# Altium schematic sheet Sheet1.SchDoc
size A4
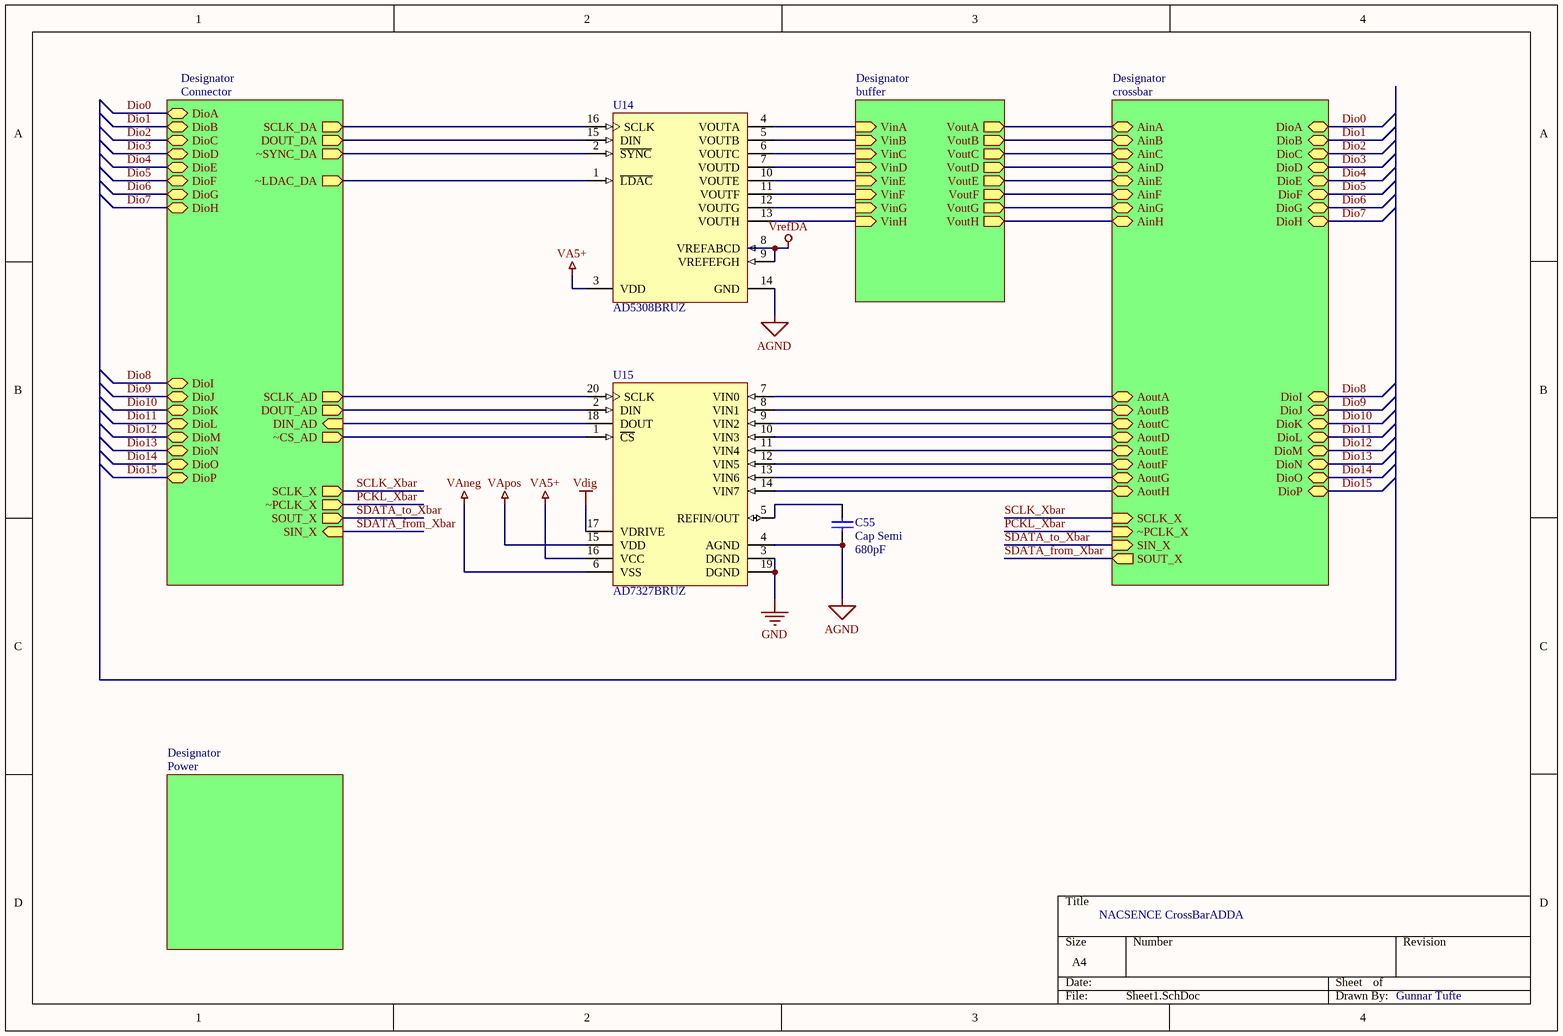
[diagram p0: Sheet1.SchDoc]

## Parts
C55  Cap Semi  value 680pF  [C1206]
U14  AD5308BRUZ  [RU-16_N]
U15  AD7327BRUZ  [RU-20_N]

## Sub-sheets
Designator = buffer: VinA (in), VinB (in), VinC (in), VinD (in), VinE (in), VinF (in), VinG (in), VinH (in), VoutA (out), VoutB (out), VoutC (out), VoutD (out), VoutE (out), VoutF (out), VoutG (out), VoutH (out)
Designator = crossbar: AinA, AinB, AinD, AinC, AinE, AinF, AinG, AinH, AoutA, AoutB, AoutD, AoutC, AoutE, AoutF, AoutG, AoutH, DioA, DioB, DioC, DioD, DioE, DioG, DioF, DioH, DioI, DioJ, DioK, DioL, DioM, DioN, DioO, DioP, SOUT_X (out), SIN_X (in), ~PCLK_X (in), SCLK_X (in)
Designator = Connector: SCLK_DA (out), DOUT_DA (out), ~SYNC_DA (out), ~LDAC_DA (out), SCLK_AD (out), DOUT_AD (out), DIN_AD (in), ~CS_AD (out), SCLK_X (out), ~PCLK_X (out), SOUT_X (out), SIN_X (in), DioA, DioB, DioC, DioD, DioE, DioG, DioF, DioH, DioI, DioJ, DioK, DioL, DioM, DioN, DioO, DioP
Designator = Power: no entries

## Nets
AGND: C55.2 U14.14(GND) U15.4(AGND)
GND: U15.3(DGND) U15.19(DGND)
VA5+: U14.3(VDD) U15.16(VCC)
VAneg: U15.6(VSS)
VApos: U15.15(VDD)
Vdig: U15.17(VDRIVE)
VrefDA: U14.8(VREFABCD) U14.9(VREFEFGH)
Dio0: sheet Designator/DioA, sheet Designator/DioA
Dio1: sheet Designator/DioB, sheet Designator/DioB
Dio2: sheet Designator/DioC, sheet Designator/DioC
Dio3: sheet Designator/DioD, sheet Designator/DioD
Dio4: sheet Designator/DioE, sheet Designator/DioE
Dio5: sheet Designator/DioF, sheet Designator/DioF
Dio6: sheet Designator/DioG, sheet Designator/DioG
Dio7: sheet Designator/DioH, sheet Designator/DioH
Dio8: sheet Designator/DioI, sheet Designator/DioI
Dio9: sheet Designator/DioJ, sheet Designator/DioJ
Dio10: sheet Designator/DioK, sheet Designator/DioK
Dio11: sheet Designator/DioL, sheet Designator/DioL
Dio12: sheet Designator/DioM, sheet Designator/DioM
Dio13: sheet Designator/DioN, sheet Designator/DioN
Dio14: sheet Designator/DioO, sheet Designator/DioO
Dio15: sheet Designator/DioP, sheet Designator/DioP
PCKL_Xbar: sheet Designator/~PCLK_X, sheet Designator/~PCLK_X
SCLK_Xbar: sheet Designator/SCLK_X, sheet Designator/SCLK_X
SDATA_from_Xbar: sheet Designator/SOUT_X, sheet Designator/SIN_X
SDATA_to_Xbar: sheet Designator/SIN_X, sheet Designator/SOUT_X
NetC55_1: C55.1 U15.5(REFIN/OUT)
NetU14_1: U14.1(~{LDAC}) ; sheet Designator/~LDAC_DA
NetU14_2: U14.2(~{SYNC}) ; sheet Designator/~SYNC_DA
NetU14_4: U14.4(VOUTA) ; sheet Designator/VinA
NetU14_5: U14.5(VOUTB) ; sheet Designator/VinB
NetU14_6: U14.6(VOUTC) ; sheet Designator/VinC
NetU14_7: U14.7(VOUTD) ; sheet Designator/VinD
NetU14_10: U14.10(VOUTE) ; sheet Designator/VinE
NetU14_11: U14.11(VOUTF) ; sheet Designator/VinF
NetU14_12: U14.12(VOUTG) ; sheet Designator/VinG
NetU14_13: U14.13(VOUTH) ; sheet Designator/VinH
NetU14_15: U14.15(DIN) ; sheet Designator/DOUT_DA
NetU14_16: U14.16(SCLK) ; sheet Designator/SCLK_DA
NetU15_1: U15.1(~{CS}) ; sheet Designator/~CS_AD
NetU15_2: U15.2(DIN) ; sheet Designator/DOUT_AD
NetU15_7: U15.7(VIN0) ; sheet Designator/AoutA
NetU15_8: U15.8(VIN1) ; sheet Designator/AoutB
NetU15_9: U15.9(VIN2) ; sheet Designator/AoutC
NetU15_10: U15.10(VIN3) ; sheet Designator/AoutD
NetU15_11: U15.11(VIN4) ; sheet Designator/AoutE
NetU15_12: U15.12(VIN5) ; sheet Designator/AoutF
NetU15_13: U15.13(VIN6) ; sheet Designator/AoutG
NetU15_14: U15.14(VIN7) ; sheet Designator/AoutH
NetU15_18: U15.18(DOUT) ; sheet Designator/DIN_AD
NetU15_20: U15.20(SCLK) ; sheet Designator/SCLK_AD
(unnamed): sheet Designator/VoutA, sheet Designator/AinA
(unnamed): sheet Designator/VoutB, sheet Designator/AinB
(unnamed): sheet Designator/VoutC, sheet Designator/AinC
(unnamed): sheet Designator/VoutD, sheet Designator/AinD
(unnamed): sheet Designator/VoutE, sheet Designator/AinE
(unnamed): sheet Designator/VoutF, sheet Designator/AinF
(unnamed): sheet Designator/VoutG, sheet Designator/AinG
(unnamed): sheet Designator/VoutH, sheet Designator/AinH

## Notes on the sheet
- NACSENCE CrossBarADDA
- Gunnar Tufte

## Library data of the parts
C55 = Cap Semi: Capacitor (Semiconductor SIM Model); Published: 8-Jun-2000; LatestRevisionDate: 29-May-2009; LatestRevisionNote: IPC-7351 Footprint Added.; PackageReference: C1206; Publisher: Altium Limited; PackageDescription: Chip Capacitor
U14 = AD5308BRUZ: Octal 8-Bit Voltage Output Digital-to-Analog Converter, 2.5 to 5.5 V, -40 to +125 degC, RU-16, Pb-Free, Tube; ADI Part Number: AD5308; Manufacturer: Analog Devices; # DAC Outputs: 8; Max V+: 5.5V; Op Pwr Diss: 5mW; Settling Time: 6µs; Single Supply: Yes; DatasheetVersion: Rev.F; PackageVersion: Nov-2002; PackageReference: RU-16; PackageDescription: 16-Lead Thin Shrink Small Outline Package [TSSOP]; Packing: Tube; Resolution (Bits): 8; RoHS: Y; Mounting Technology: Surface Mount; Code_JEDEC: MO-153-AB; ComponentLink1Description: Manufacturer URL; ComponentLink1URL: http://www.analog.com/en/index.html; ComponentLink2Description: Datasheet; ComponentLink2URL: http://www.analog.com/static/imported-files/data_sheets/AD5308_5318_5328.pdf; ComponentLink3Description: Package Specification; ComponentLink3URL: http://www.analog.com/static/imported-files/packages/36244347913743854010197452789RU16.pdf; ComponentLink4Description: URL Link1; ComponentLink4URL: Product URL:http://www.analog.com/en/digital-to-analog-converters/da-converters/ad5308/products/product.html
U15 = AD7327BRUZ: Octal 12-Bit True Bipolar Input Plus Sign Analog-to-Digital Converter with Serial, SPI Interface, Software-Selectable, 500KSPS, -40 to +85 degC, RU-20, Pb-Free, Tube; Part Number: AD7327; Manufacturer: Analog Devices; Resolution (Bits): 13; Channels: 8; Throughput Rate (SPS): 500K; Interface: Ser, SPI; DatasheetVersion: Rev.A; PackageVersion: 2000; PackageReference: RU-20; PackageDescription: 20-Lead Thin Shrink Small Outline Package [TSSOP]; RoHS: Y; Packing: Tube; Mounting Technology: Surface Mount; Code_JEDEC: MO-153AC; ComponentLink1Description: Manufacturer URL; ComponentLink1URL: http://www.analog.com/en/index.html; ComponentLink2Description: Datasheet; ComponentLink2URL: http://www.analog.com/static/imported-files/data_sheets/AD7327.pdf; ComponentLink3Description: Package Specification; ComponentLink3URL: http://www.analog.com/static/imported-files/packages/364515793657813558433715854054607941441RU20.pdf; ComponentLink4Description: Product URL; ComponentLink4URL: http://www.analog.com/en/analog-to-digital-converters/ad-converters/ad7327/products/product.html